# Altium project Assessment_2.PrjPcb
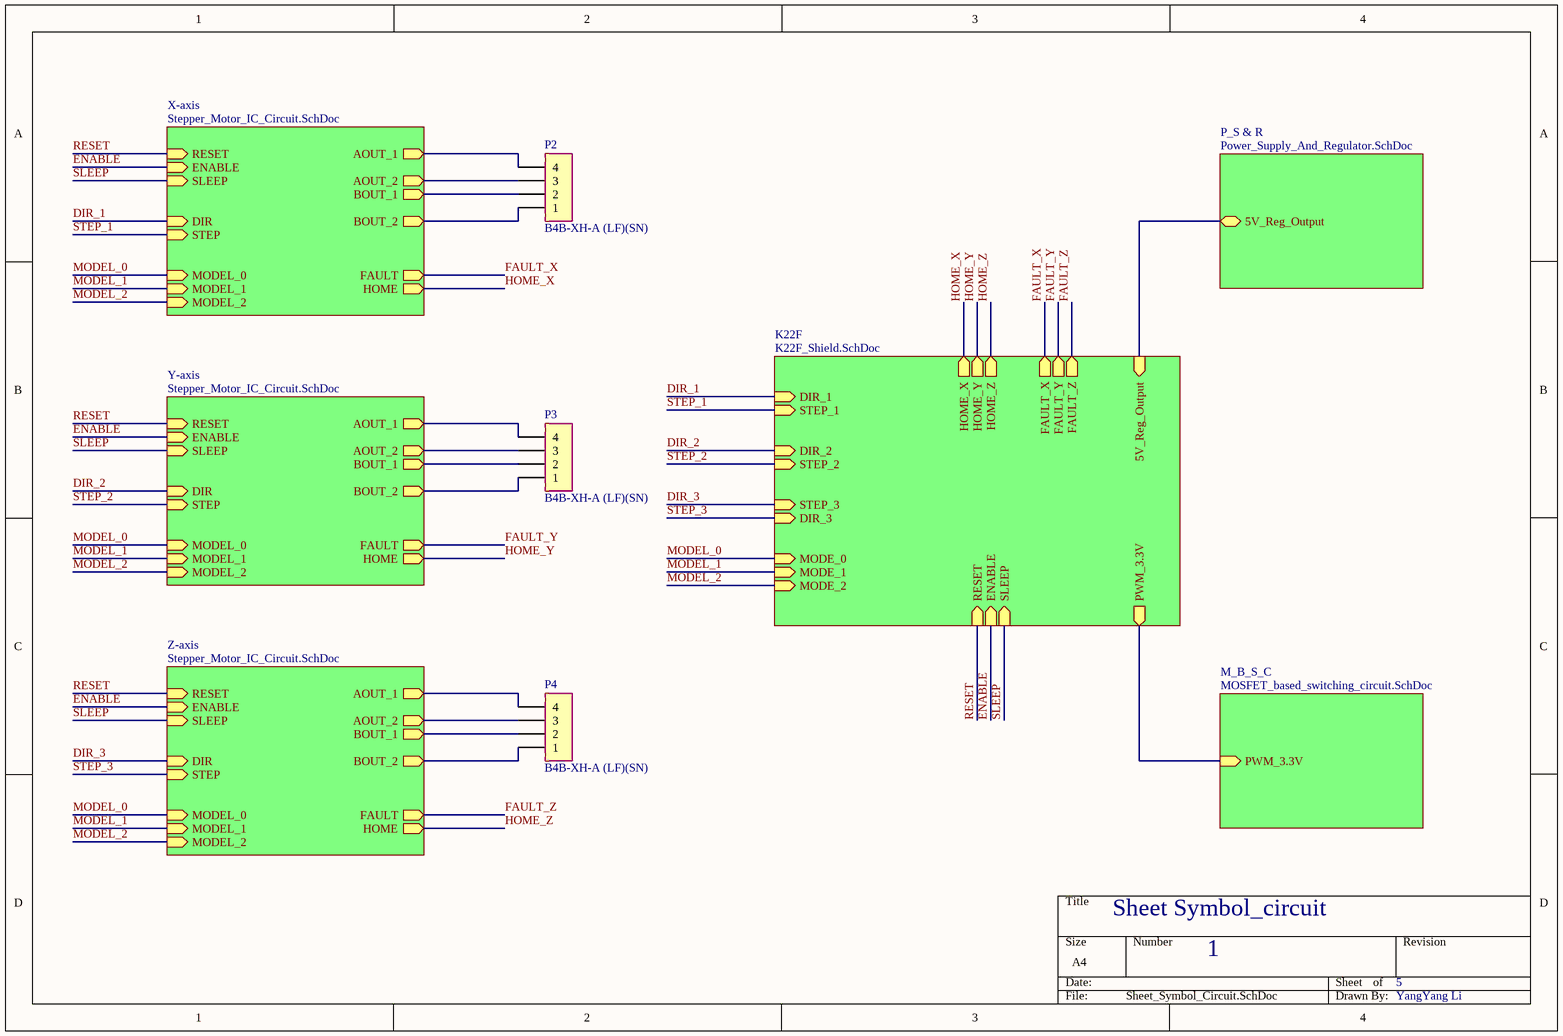
[diagram p0: Sheet_Symbol_Circuit.SchDoc]
5 sheets, 59 parts. Net scope: hierarchical (ports join the sheet entries above them; power ports are global).
Board files: PCB1.PcbDoc, Assessment_2_PCB.PcbDoc
Sheets:
  Sheet_Symbol_Circuit.SchDoc
    X-axis = Stepper_Motor_IC_Circuit.SchDoc
    Y-axis = Stepper_Motor_IC_Circuit.SchDoc
    Z-axis = Stepper_Motor_IC_Circuit.SchDoc
    K22F = K22F_Shield.SchDoc
    P_S & R = Power_Supply_And_Regulator.SchDoc
    M_B_S_C = MOSFET_based_switching_circuit.SchDoc

## Sheet Sheet_Symbol_Circuit.SchDoc
size A4; DocumentNumber: 1; SheetNumber: 1

### Parts
P2  B4B-XH-A (LF)(SN)  [B4B-XH-A (LF)(SN)]
P3  B4B-XH-A (LF)(SN)  [B4B-XH-A (LF)(SN)]
P4  B4B-XH-A (LF)(SN)  [B4B-XH-A (LF)(SN)]

### Sub-sheets
K22F = K22F_Shield.SchDoc: MODE_2 (in), MODE_0 (in), MODE_1 (in), SLEEP (in), ENABLE (in), RESET (in), PWM_3.3V (out), DIR_1 (in), STEP_1 (in), DIR_2 (in), STEP_2 (in), STEP_3 (in), DIR_3 (in), HOME_Y (out), HOME_Z (out), HOME_X (out), 5V_Reg_Output (in), FAULT_Y (out), FAULT_X (out), FAULT_Z (out)
M_B_S_C = MOSFET_based_switching_circuit.SchDoc: PWM_3.3V (in)
P_S & R = Power_Supply_And_Regulator.SchDoc: 5V_Reg_Output (bidir)
X-axis = Stepper_Motor_IC_Circuit.SchDoc: AOUT_1 (out), AOUT_2 (out), BOUT_1 (out), BOUT_2 (out), DIR (in), STEP (in), MODEL_0 (in), MODEL_1 (in), MODEL_2 (in), RESET (in), ENABLE (in), SLEEP (in), FAULT (out), HOME (out)
Y-axis = Stepper_Motor_IC_Circuit.SchDoc: AOUT_1 (out), AOUT_2 (out), BOUT_1 (out), BOUT_2 (out), DIR (in), STEP (in), MODEL_0 (in), MODEL_1 (in), MODEL_2 (in), RESET (in), ENABLE (in), SLEEP (in), FAULT (out), HOME (out)
Z-axis = Stepper_Motor_IC_Circuit.SchDoc: AOUT_1 (out), AOUT_2 (out), BOUT_1 (out), BOUT_2 (out), DIR (in), STEP (in), MODEL_0 (in), MODEL_1 (in), MODEL_2 (in), RESET (in), ENABLE (in), SLEEP (in), HOME (out), FAULT (out)

### Nets
DIR_1: sheet X-axis/DIR, sheet K22F/DIR_1
DIR_2: sheet Y-axis/DIR, sheet K22F/DIR_2
DIR_3: sheet Z-axis/DIR, sheet K22F/STEP_3
ENABLE: sheet X-axis/ENABLE, sheet Y-axis/ENABLE, sheet Z-axis/ENABLE, sheet K22F/ENABLE
FAULT_X: sheet X-axis/FAULT, sheet K22F/FAULT_X
FAULT_Y: sheet Y-axis/FAULT, sheet K22F/FAULT_Y
FAULT_Z: sheet Z-axis/FAULT, sheet K22F/FAULT_Z
HOME_X: sheet X-axis/HOME, sheet K22F/HOME_X
HOME_Y: sheet Y-axis/HOME, sheet K22F/HOME_Y
HOME_Z: sheet Z-axis/HOME, sheet K22F/HOME_Z
MODEL_0: sheet X-axis/MODEL_0, sheet Y-axis/MODEL_0, sheet Z-axis/MODEL_0, sheet K22F/MODE_0
MODEL_1: sheet X-axis/MODEL_1, sheet Y-axis/MODEL_1, sheet Z-axis/MODEL_1, sheet K22F/MODE_1
MODEL_2: sheet X-axis/MODEL_2, sheet Y-axis/MODEL_2, sheet Z-axis/MODEL_2, sheet K22F/MODE_2
RESET: sheet X-axis/RESET, sheet Y-axis/RESET, sheet Z-axis/RESET, sheet K22F/RESET
SLEEP: sheet X-axis/SLEEP, sheet Y-axis/SLEEP, sheet Z-axis/SLEEP, sheet K22F/SLEEP
STEP_1: sheet X-axis/STEP, sheet K22F/STEP_1
STEP_2: sheet Y-axis/STEP, sheet K22F/STEP_2
STEP_3: sheet Z-axis/STEP, sheet K22F/DIR_3
Net*1_J24_2: sheet K22F/PWM_3.3V, sheet M_B_S_C/PWM_3.3V
Net*1_J25_16: sheet K22F/5V_Reg_Output, sheet P_S & R/5V_Reg_Output
NetP2_1: P2.1 ; sheet X-axis/BOUT_2
NetP2_2: P2.2 ; sheet X-axis/BOUT_1
NetP2_3: P2.3 ; sheet X-axis/AOUT_2
NetP2_4: P2.4 ; sheet X-axis/AOUT_1
NetP3_1: P3.1 ; sheet Y-axis/BOUT_2
NetP3_2: P3.2 ; sheet Y-axis/BOUT_1
NetP3_3: P3.3 ; sheet Y-axis/AOUT_2
NetP3_4: P3.4 ; sheet Y-axis/AOUT_1
NetP4_1: P4.1 ; sheet Z-axis/BOUT_2
NetP4_2: P4.2 ; sheet Z-axis/BOUT_1
NetP4_3: P4.3 ; sheet Z-axis/AOUT_2
NetP4_4: P4.4 ; sheet Z-axis/AOUT_1

### Notes on the sheet
- Sheet Symbol_circuit
- 1
- 5
- YangYang Li

### Library data of the parts
P2-P4 = B4B-XH-A (LF)(SN) Wire-to-board connector: Wire-to-board connector, vertical, 2.5mm, 4 contacts

## Sheet Stepper_Motor_IC_Circuit.SchDoc
size A4; DocumentNumber: 3; SheetNumber: 3
Used 3 times, as channels X-axis, Y-axis, Z-axis. Parts and nets are listed once, with the designators drawn on the sheet.
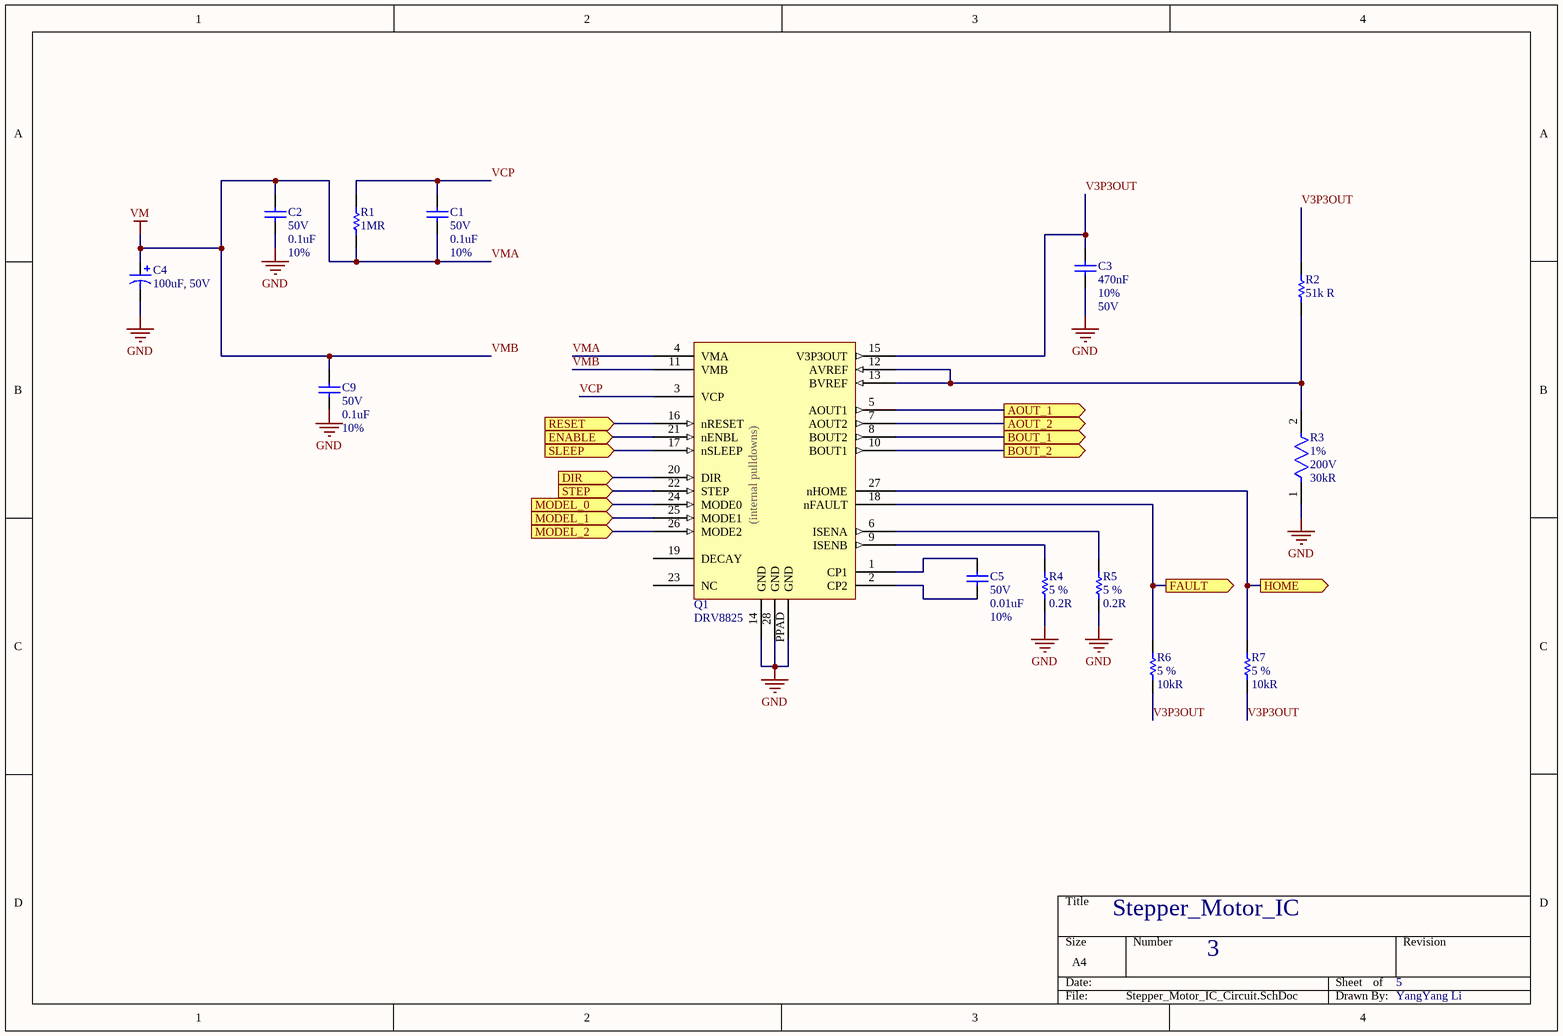
[diagram p1: Stepper_Motor_IC_Circuit.SchDoc]

### Parts
C1  Voltage Rating: 50V  Capacitance: 0.1uF  Tolerance: 10%  [KEMT-1206-2_L]  (hidden comment: C1206C103K5RACTU)
C2  Voltage Rating: 50V  Capacitance: 0.1uF  Tolerance: 10%  [KEMT-1206-2_L]  (hidden comment: C1206C103K5RACTU)
C3  Capacitance - nF: 470nF  Tolerance: 10%  Voltage Rating: 50V  [CAPC3216X100X50NL20T25]  (hidden comment: 1206C474K5RACTU)
C4  100uF, 50V  [Capacitor radial 8mm]
C5  Voltage Rating: 50V  Capacitance: 0.01uF  Tolerance: 10%  [KEMT-1206-2_L]  (hidden comment: C1206C103K5RACTU)
C9  Voltage Rating: 50V  Capacitance: 0.1uF  Tolerance: 10%  [KEMT-1206-2_L]  (hidden comment: C1206C103K5RACTU)
Q1  DRV8825  [DRV8825 HTSSOP]
R1  Resistance: 1MR  [RESC3216X70X50NL05T20]  (hidden comment: ERJ-8ENF1004V)
R2  51k R  [RESC3216X60X45NL10T20]
R3  Tolerance: 1%  Voltage Rating: 200V  Resistance: 30kR  [FP-CR1206-MFG]  (hidden comment: CR1206-FX-3002ELF)
R4  value 0.2R  Tolerance: 5 %  [RESC1206(3216)_L]  (hidden comment: 0.2R 5% 1206(3216))
R5  value 0.2R  Tolerance: 5 %  [RESC1206(3216)_L]  (hidden comment: 0.2R 5% 1206(3216))
R6  value 10kR  Tolerance: 5 %  [RESC1206(3216)_M]  (hidden comment: 10K 5% 1206(3216))
R7  value 10kR  Tolerance: 5 %  [RESC1206(3216)_M]  (hidden comment: 10K 5% 1206(3216))

### Ports
AOUT_1 (out), AOUT_2 (out), BOUT_1 (out), BOUT_2 (out), DIR (in), ENABLE (in), FAULT (out), HOME (out), MODEL_0 (in), MODEL_1 (in), MODEL_2 (in), RESET (in), SLEEP (in), STEP (in)

### Nets
GND: C2.2 C3.2 C4.2 C9.2 Q1.14(GND) Q1.28(GND) Q1.PPAD(GND) R3.1 R4.2 R5.2
VMA: C1.2 C2.1 C4.1 C9.1 Q1.4(VMA) Q1.11(VMB) R1.2  [also labelled VM, VMB]
AOUT_1: Q1.5(AOUT1) ; port AOUT_1
AOUT_2: Q1.7(AOUT2) ; port AOUT_2
BOUT_1: Q1.8(BOUT2) ; port BOUT_1
BOUT_2: Q1.10(BOUT1) ; port BOUT_2
DIR: Q1.20(DIR) ; port DIR
ENABLE: Q1.21(nENBL) ; port ENABLE
FAULT: Q1.18(nFAULT) R6.2 ; port FAULT
HOME: Q1.27(nHOME) R7.2 ; port HOME
MODEL_0: Q1.24(MODE0) ; port MODEL_0
MODEL_1: Q1.25(MODE1) ; port MODEL_1
MODEL_2: Q1.26(MODE2) ; port MODEL_2
RESET: Q1.16(nRESET) ; port RESET
SLEEP: Q1.17(nSLEEP) ; port SLEEP
STEP: Q1.22(STEP) ; port STEP
V3P3OUT: C3.1 Q1.15(V3P3OUT) R2.2 R6.1 R7.1
VCP: C1.1 Q1.3(VCP) R1.1
NetC5_1: C5.1 Q1.2(CP2)
NetC5_2: C5.2 Q1.1(CP1)
NetQ1_6: Q1.6(ISENA) R5.1
NetQ1_9: Q1.9(ISENB) R4.1
NetQ1_12: Q1.12(AVREF) Q1.13(BVREF) R2.1 R3.2

Not connected (* = marked no-connect by the designer): Q1 19(DECAY) 23(NC)

### Channels
X-axis: designators end in _X-axis; ports AOUT_1=NetP2_4 AOUT_2=NetP2_3 BOUT_1=NetP2_2 BOUT_2=NetP2_1 DIR=DIR_1 ENABLE=ENABLE FAULT=FAULT_X HOME=HOME_X MODEL_0=MODEL_0 MODEL_1=MODEL_1 MODEL_2=MODEL_2 RESET=RESET SLEEP=SLEEP STEP=STEP_1
Y-axis: designators end in _Y-axis; ports AOUT_1=NetP3_4 AOUT_2=NetP3_3 BOUT_1=NetP3_2 BOUT_2=NetP3_1 DIR=DIR_2 ENABLE=ENABLE FAULT=FAULT_Y HOME=HOME_Y MODEL_0=MODEL_0 MODEL_1=MODEL_1 MODEL_2=MODEL_2 RESET=RESET SLEEP=SLEEP STEP=STEP_2
Z-axis: designators end in _Z-axis; ports AOUT_1=NetP4_4 AOUT_2=NetP4_3 BOUT_1=NetP4_2 BOUT_2=NetP4_1 DIR=DIR_3 ENABLE=ENABLE FAULT=FAULT_Z HOME=HOME_Z MODEL_0=MODEL_0 MODEL_1=MODEL_1 MODEL_2=MODEL_2 RESET=RESET SLEEP=SLEEP STEP=STEP_3

### Notes on the sheet
- Stepper_Motor_IC
- 3
- 5
- YangYang Li
- (in symbol Stepper motor driver DRV8824) (internal pulldowns)

### Library data of the parts
C1 C2 C5 C9 = CMP-2000-06008-1: Surface Mount Multilayer Ceramic Chip Capacitor, X7R Dielectric, 50 V, -55 to 125 degC, 2-Pin SMD (1206), RoHS, Tape and Reel; Manufacturer: Kemet; Brand/Series: CSeries; Mounting Technology: SurfaceMount; Material, Element: Ceramic; Termination: SMD; Temperature Coefficient: X7R; Package Reference: 1206-2; Dimensions: 0.126"x0.063"(3.2x1.6mm)LxW; Package Description: 2-Leads SMD, Body 3.2 x 1.6 mm; Datasheet Version: 07/2013; Manufacturer URL: http://www.kemet.com/; Mounting Type: PCB; Case Size: 1206(3216mm); Datasheet URL: https://datasheet.ciiva.com/7729/1725435-7729792.pdf
C3 = CMP-2000-06016-1: Chip Capacitor, 470 nF, +/- 10%, 50 V, -55 to 125 degC, 1206 (3216 Metric), RoHS, Tape and Reel; Manufacturer: Kemet; Case Length: 3.2mm; Class: 2; Case Height: 0.9mm; Capacitance - pF: 470000pF; Dielectric: X7R; Case Width: 1.6mm; Temperature Coefficient / Code: +/-15%; Type: SMDMLCCsX7R,Commercial; Manufacturer URL: http://www.kemet.com/; Maximum Operating Temperature: +125C; Minimum Operating Temperature: -55C; Brand: Kemet; Case Code - in: 1206; Datasheet Version: 02/2016; Case Code - mm: 3216; Series: C1206C; Mounting Technology: SurfaceMount; Package Reference: 1206; Termination Style: SMD/SMT; Datasheet URL: http://www.kemet.com/docfinder?Partnumber=C1206C106K8RACTU; Dimensions: 1.6mmWx3.2mmLx0.9mmH; Packaging: Reel; Factory Pack Quantity: 4000; Product Category: MultilayerCeramicCapacitorsMLCC-SMD/SMT; RoHS: Details; Operating Temperature Range: -55Cto+125C; Product: GeneralTypeMLCCs; Voltage Rating DC: 50V; Package Description: 2-Pin Surface Mount Device, Body 3.2 x 1.6 mm; Package / Case: 1206(3216metric)
C4 = Cap 100uF, 50V, THT radial: Electrolytic Capacitor, 100 µF, 50 V, ± 20%, Radial Leaded, 8 mm
Q1 = Stepper motor driver DRV8824: TI DRV8825 Stepper Motor Controller IC
R1 = CMP-2003-00020-1: Manufacturer: Panasonic; Part Number: ERJ-8ENF1004V
R2 = CMP-2003-02261-1: CRCW120651K0JNEA; Manufacturer: Vishay Dale; Part Number: CRCW120651K0JNEA
R3 = CMP-07231-000998-1: Thick Film Chip Resistors 1206 30kΩ 0.25W 1% 100ppm/°C; Max Power Dissipation: 250mW; Max Operating Temperature: 155°C; Width: 1.6mm; Contact Plating: Tin; Thickness: 610um; Mount: Surface Mount; Case/Package: 1206; Package Quantity: 5000; Radiation Hardening: No; Case Code (Metric): 3216; Termination: SMD/SMT; Temperature Coefficient: 100ppm/°C; Power Rating: 250mW; Min Operating Temperature: -55°C; Number of Terminations: 2; Composition: Thick Film; Height: 0.03inch; Length: 3.2mm; Packaging: Tape and Reel; Depth: 1.6mm; Case Code (Imperial): 1206; Military Standard: Not
R4 R5 = CMP-1014-00057-1: 0.2R 0.25W 5% 1206 (3216 Metric)  SMD; Case-EIA: 1206; Case-Metric: 3216; Technology: SMT; Power: 0.25 W
R6 R7 = CMP-1014-00098-1: 10K 0.25W 5% 1206 (3216 Metric)  SMD; Case-Metric: 3216; Case-EIA: 1206; Power: 0.25 W; Technology: SMT

## Sheet K22F_Shield.SchDoc
size A4; DocumentNumber: 2; SheetNumber: 2
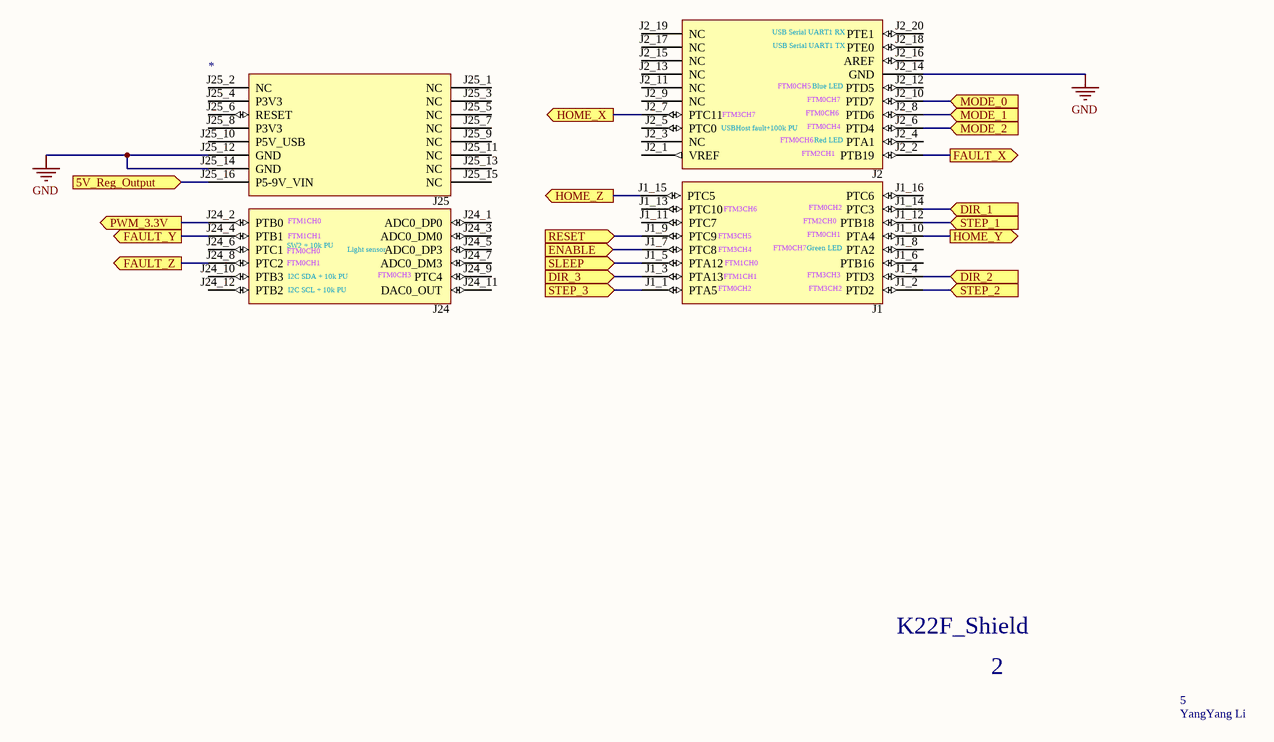
[diagram p2: K22F_Shield.SchDoc]

### Parts
*1  *  [FRDM-K22F]

### Ports
5V_Reg_Output (in), DIR_1 (in), DIR_2 (in), DIR_3 (in), ENABLE (in), FAULT_X (out), FAULT_Y (out), FAULT_Z (out), HOME_X (out), HOME_Y (out), HOME_Z (out), MODE_0 (in), MODE_1 (in), MODE_2 (in), PWM_3.3V (out), RESET (in), SLEEP (in), STEP_1 (in), STEP_2 (in), STEP_3 (in)

### Nets
GND: *1.J2_14(GND) *1.J25_12(GND) *1.J25_14(GND)
DIR_1: *1.J1_14(PTC3) ; port DIR_1
DIR_2: *1.J1_4(PTD3) ; port DIR_2
DIR_3: *1.J1_1(PTA5) ; port STEP_3
ENABLE: *1.J1_7(PTC8) ; port ENABLE
FAULT_X: *1.J2_2(PTB19) ; port FAULT_X
FAULT_Y: *1.J24_4(PTB1) ; port FAULT_Y
FAULT_Z: *1.J24_8(PTC2) ; port FAULT_Z
HOME_X: *1.J2_7(PTC11) ; port HOME_X
HOME_Y: *1.J1_10(PTA4) ; port HOME_Y
HOME_Z: *1.J1_15(PTC5) ; port HOME_Z
MODEL_0: *1.J2_10(PTD7) ; port MODE_0
MODEL_1: *1.J2_8(PTD6) ; port MODE_1
MODEL_2: *1.J2_6(PTD4) ; port MODE_2
RESET: *1.J1_9(PTC9) ; port RESET
SLEEP: *1.J1_5(PTA12) ; port SLEEP
STEP_1: *1.J1_12(PTB18) ; port STEP_1
STEP_2: *1.J1_2(PTD2) ; port STEP_2
STEP_3: *1.J1_3(PTA13) ; port DIR_3
Net*1_J24_2: *1.J24_2(PTB0) ; port PWM_3.3V
Net*1_J25_16: *1.J25_16(P5-9V_VIN) ; port 5V_Reg_Output

Not connected (* = marked no-connect by the designer): *1 J1_6(PTB16) J1_8(PTA2) J1_11(PTC7) J1_13(PTC10) J1_16(PTC6) J2_1(VREF) J2_3(NC) J2_4(PTA1) J2_5(PTC0) J2_9(NC) J2_11(NC) J2_12(PTD5) J2_13(NC) J2_15(NC) J2_16(AREF) J2_17(NC) J2_18(PTE0) J2_19(NC) J2_20(PTE1) J24_1(ADC0_DP0) J24_3(ADC0_DM0) J24_5(ADC0_DP3) J24_6(PTC1) J24_7(ADC0_DM3) J24_9(PTC4) J24_10(PTB3) J24_11(DAC0_OUT) J24_12(PTB2) J25_1(NC) J25_2(NC) J25_3(NC) J25_4(P3V3) J25_5(NC) J25_6(RESET) J25_7(NC) J25_8(P3V3) J25_9(NC) J25_10(P5V_USB) J25_11(NC) J25_13(NC) J25_15(NC)

### Notes on the sheet
- K22F_Shield
- 2
- 5
- YangYang Li
- (in symbol NXP FRDM-K22F) USB Serial UART1 RX; USB Serial UART1 TX; FTM0CH5; Blue LED; FTM0CH7; FTM3CH7; FTM0CH6; USBHost fault+100k PU; FTM0CH4; Red LED; FTM2CH1; J2; J25; FTM3CH6; FTM0CH2; FTM1CH0; FTM2CH0; FTM1CH1; FTM3CH5; FTM0CH1; SW2 + 10k PU; FTM0CH0; Light sensor; FTM3CH4; Green LED; I2C SDA + 10k PU; FTM0CH3; FTM3CH3; I2C SCL + 10k PU; FTM3CH2; J24; J1

### Library data of the parts
*1 = NXP FRDM-K22F

## Sheet Power_Supply_And_Regulator.SchDoc
size A4; DocumentNumber: 4; SheetNumber: 4
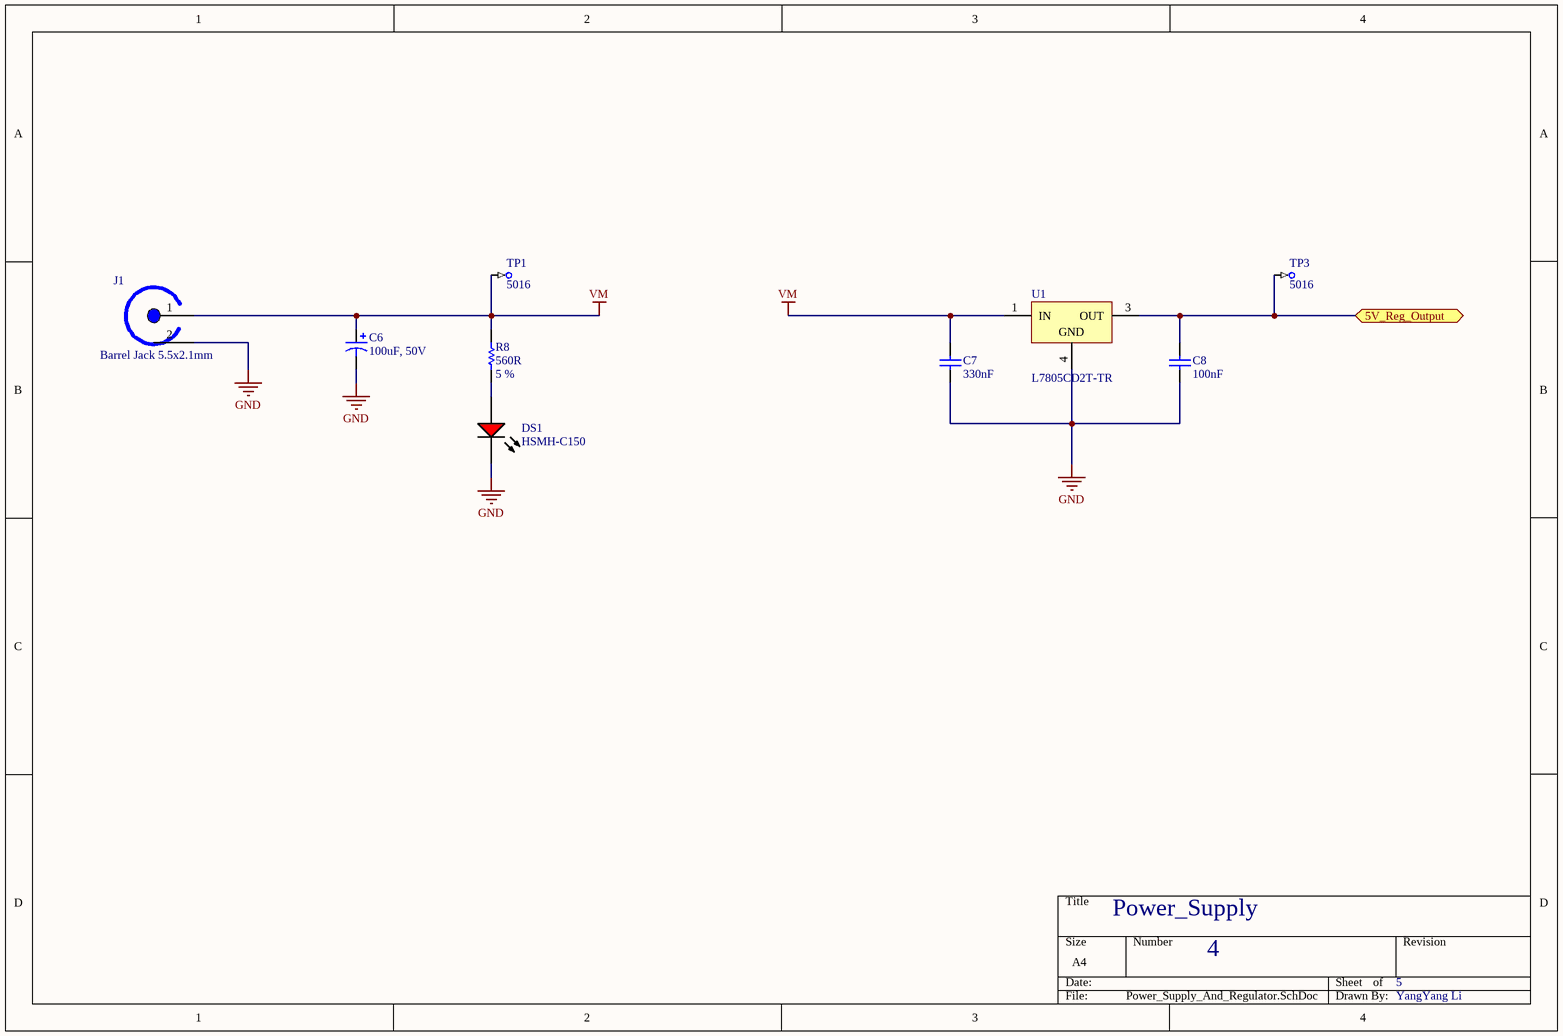
[diagram p3: Power_Supply_And_Regulator.SchDoc]

### Parts
C6  100uF, 50V  [Capacitor radial 8mm]
C7  330nF  [CAPC1608X87X35NL15T15]
C8  100nF  [CAPC2013X88X50NL20T25]
DS1  HSMH-C150  [AVAG-HSMX-C150_V]
J1  Barrel Jack 5.5x2.1mm  [Barrel Jack 2.1x5.5mm THT]
R8  value 560R  Tolerance: 5 %  [RESC1206(3216)_L]  (hidden comment: 560R 5% 1206(3216))
TP1  5016  [KEYSTONE-5016_V]
TP3  5016  [KEYSTONE-5016_V]
U1  L7805CD2T-TR  [TO-263_M]

### Ports
5V_Reg_Output (bidir)

### Nets
GND: C6.2 C7.1 C8.1 DS1.2(K) J1.2(SLEEVE) U1.4(GND)
VM: C6.1 C7.2 J1.1(TIP) R8.2 TP1.1 U1.1(IN)  [project net VMA]
Net*1_J25_16: C8.2 TP3.1 U1.3(OUT) ; port 5V_Reg_Output
NetDS1_1: DS1.1(A) R8.1

### Notes on the sheet
- Power_Supply
- 4
- 5
- YangYang Li

### Library data of the parts
C6 = Cap 100uF, 50V, THT radial: as C4 on sheet Stepper_Motor_IC_Circuit
C7 = CMP-2006-03186-1: C0603C334K4RACTU; Manufacturer: Kemet; Part Number: C0603C334K4RACTU
C8 = CMP-2007-00279-1: C0805C104K5RACTU; Manufacturer: Kemet; Part Number: C0805C104K5RACTU
DS1 = CMP-2000-06426-1: LED Uni-Color Red, 65 mW, 25 mA, -40 to 85 degC, 2-Pin SMD, RoHS, Tape and Reel; Manufacturer: Avago; Product Height (mm): 1.1mm; Power Dissipation: 78W; Product Length (mm): 3.2mm; Forward Voltage: 2.6V; Luminous Intensity: 17mcd; DELETED: Compliant; Shape Type: Rectangular; Peak Wavelength: 660nm; Main Category: ChipLED; Dominant Wave Length: 639nm; Rad Hardened: No; Lens Type: ColorlessDiffused; Product Depth (mm): 1.6mm; Reverse Voltage: 5V; Forward Current: 25mA; Chip Material: GaAlAs; Test Current (It): 20mA; Viewing Angle: 170deg; Number of  Elements: 1; Type: Uni-Color; Package Reference: HSMX-C150; Package Description: 2-Pin Surface Mount Device, Body 3.2 x 1.6 mm; Operating Temp Range: -40Cto85C; Mounting: SurfaceMount; Emitting Color: Red; Pin Count: 2; Operating Temperature Classification: Industrial; Datasheet URL: http://media.digikey.com/pdf/Data%20Sheets/Avago%20PDFs/HSMz-Czzz.pdf; Package Type: ChipLed; Mounting Technology: SurfaceMount; High Brightness: No; Lens Dimensions: 2x1.6x0.6mm; Manufacturer URL: http://www.avagotech.com/; Lum Intensity: 17mcd; Datasheet Version: 03/2012; Packaging: TapeandReel
J1 = Barrel Jack 5.5x2.1mm: GCT DCJ200-10-A-K1-K
R8 = CMP-1014-00068-1: 560R 0.25W 5% 1206 (3216 Metric)  SMD; Case-Metric: 3216; Case-EIA: 1206; Power: 0.25 W; Technology: SMT
TP1 TP3 = CMP-2000-05178-1: Test Point, 1-Pin SMT, RoHS, Tape and Reel; Manufacturer: Keystone; Other Names: 5016KDKR; Featured Product: SurfaceMountTestPoints / 5019MiniatureSurfaceMountTestPoint; Online Catalog: SurfaceMountTestPoints; Catalog Drawings: 5016Top / 5016Side / 5016Front; Packaging: Digi-Reel; RoHS Information: RoHSComplianceStatement; Package Reference: 5016; Mounting Type: SurfaceMount; Type: PCTestPoint,Compact; Manufacturer URL: http://www.keyelco.com/; Standard Package: 1; Package Description: 1-Pin Test Point, Body 3.81 x 2.04 mm; Category: TestandMeasurement; Terminal: 0.015"(0.38mm)PhosphorBronze,SilverPlated; Datasheet URL: https://ciiva.com/datasheet-click-2917613?src=ciiva&sig=4a4e90f; Datasheet Version: Rev. D, 03/2014; Family: TestPoints; Material: PhosphorBronze
U1 = CMP-0244-00213-1: Positive Voltage Regulator, 3-Pin D2PAK, Tape and Reel; PackageReference: TO-263; ComponentLink2URL: http://www.st.com/internet/com/TECHNICAL_RESOURCES/TECHNICAL_LITERATURE/DATASHEET/CD00000444.pdf; PackageDescription: 3-Pin Transistor Outline Package 2.54 mm Pitch, 15.4 mm Lead Span (D2PAK); DatasheetVersion: 16/11/2011; ComponentLink2Description: Datasheet; ComponentLink1Description: Manufacturer URL; PackageVersion: 2011; ComponentLink1URL: http://www.st.com

## Sheet MOSFET_based_switching_circuit.SchDoc: iuiuiu
size A4; DocumentNumber: 5; SheetNumber: 5
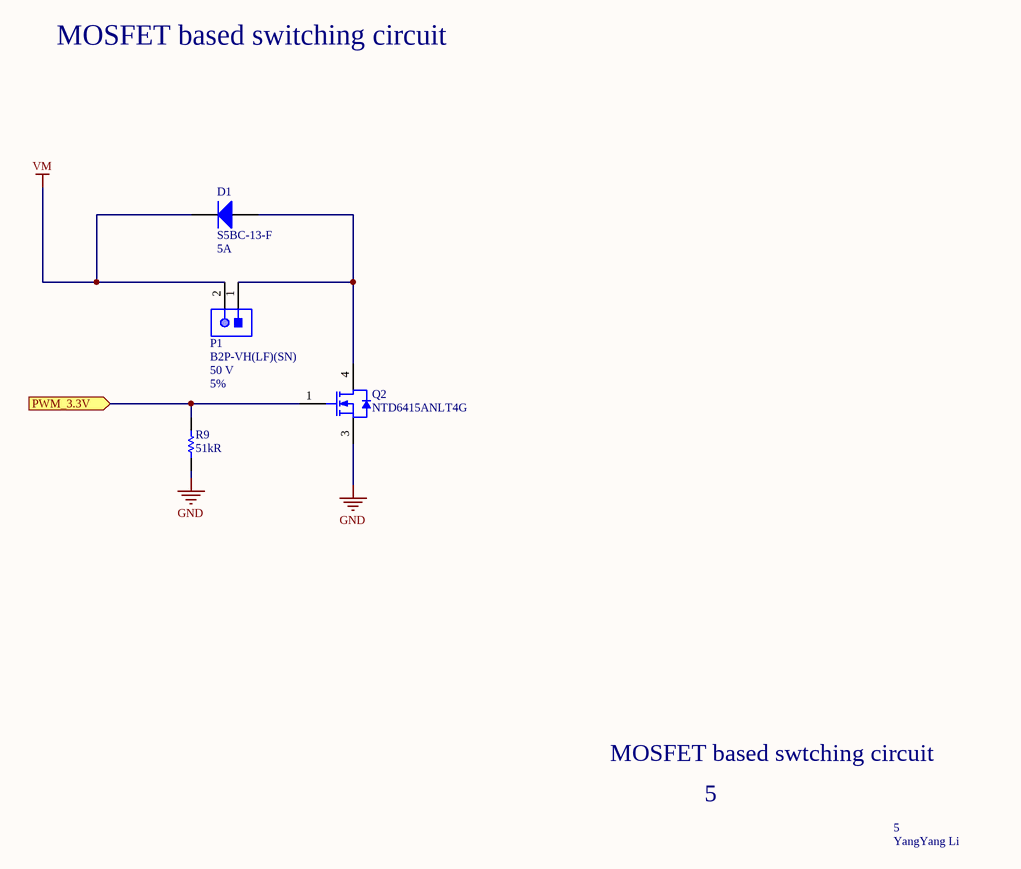
[diagram p4: MOSFET_based_switching_circuit.SchDoc]

### Parts
D1  S5BC-13-F  Average Rectified Current-Max: 5A  [DIOD-S5xC_V]
P1  B2P-VH(LF)(SN)  Voltage Rating: 50 V  Tolerance: 5%  [JST-B2P-VH(LF)(SN)_V]
Q2  NTD6415ANLT4G  [ONSC-DPAK-3-369AA-01_V]
R9  51kR  [RESC3216X60X45NL10T20]

### Ports
PWM_3.3V (in)

### Nets
GND: Q2.3(S) R9.1
VM: D1.2(K) P1.2  [project net VMA]
Net*1_J24_2: Q2.1(G) R9.2 ; port PWM_3.3V
NetD1_1: D1.1(A) P1.1 Q2.4(D)

### Notes on the sheet
- MOSFET based switching circuit
- MOSFET based swtching circuit
- 5
- YangYang Li

### Library data of the parts
D1 = CMP-2000-07025-1: Surface Mount Glass Passivated Rectifier, 5 A, 100 V, -65 to 150 degC, 2-Pin SMC, RoHS, Tape and Reel; Manufacturer: Diodes Inc; Reverse Current-Max: 10µA; Peak Current-Max: 100A; Reverse Voltage-Max [Vrrm]: 100V; Forward Voltage: 1.15V; Datasheet URL: http://www.diodes.com/_files/datasheets/ds16007.pdf; Package Description: 2-Pin Molded Component, Body 6.855 x 5.905 mm; Manufacturer URL: http://www.diodes.com/; Datasheet Version: Rev. 9-2, 09/2010; Package Reference: S5xC; Mounting Technology: SurfaceMount
P1 = CMP-1755-00002-1: Male Header, Pitch 3.96 mm, 1 x 2 Position, Height 10.9 mm, Tail Length 3.7 mm, -25 to 85 degC, RoHS, Bulk; Capacitance: 27 pF; Type (Capacitors): C0G; Resistance: 100000000000 Ohm; ComponentLink2Description: Datasheet; Height: 0.8 mm; Radiation Hardening: No; Pins: 2; Package Quantity: 4000; Max Operating Temperature: 125degC; Width: 0.8 mm; PackageDescription: Male Header, Pitch 3.96 mm, 1 x 2 Position, Height 10.9 mm, Tail Length 3.7 mm; Case/Package: 0603; Voltage Rating (DC): 50 V; PackageReference: B2P-VH(LF)(SN); REACH SVHC: No SVHC; Mount: Surface Mount; Min Operating Temperature: -55degC; Case Code (Metric): 1608; ComponentLink2URL: http://www.jst-mfg.com/product/pdf/eng/eVH.pdf; DatasheetVersion: May-16; RoHSCompliant: True; ComponentLink1Description: Manufacturer URL; Case Code (Imperial): 0603; Length: 1.6 mm; Packaging: Tape and Reel; ComponentLink1URL: http://www.jst.com/home2.html
Q2 = CMP-1058-00352-1: N-Channel Power MOSFET, 100 V, 23 A, 56 mOhm, 3-Pin DPAK, Pb-Free, Tape and Reel; Manufacturer: On Semiconductor; VGS(th) Max (V): 2; ID Max (A): 23; VGS Max (V): 20; Configuration: Single; Coss Typ (pF): 156; Crss Typ (pF): 70; Qrr Typ (nC): 152; Ciss Typ (pF): 1024; Channel Polarity: N Channel; PD Max (W): 83; ComponentLink1URL: http://www.onsemi.com/; Mounting Technology: Surface Mount; ComponentLink2URL: http://www.onsemi.cn/pub_link/Collateral/NTD6415ANL-D.PDF; RoHS: Pb-Free; PackageVersion: Rev. B, 06/2010; Packing: Tape and Reel; PackageReference: DPAK-3-369AA-01; DatasheetVersion: Rev. 1; ComponentLink1Description: Manufacturer URL; Package Type: DPAK-3; PackageDescription: 3-Pin Flange Mount, Body 6.54 x 6.095 mm, Pitch 2.29 mm; ComponentLink3URL: http://www.onsemi.cn/pub_link/Collateral/369AA.PDF; ComponentLink3Description: Package Specification; PartNumber: NTD6415ANLT4G; ComponentLink2Description: Datasheet
R9 = CMP-2003-02261-1: as R2 on sheet Stepper_Motor_IC_Circuit; Part Number: CRCW120651K0JNEA

## Nets that join several sheets
GND: X-axis (10 pins), Y-axis (10 pins), Z-axis (10 pins), K22F_Shield (*1.J2_14 *1.J25_12 *1.J25_14), Power_Supply_And_Regulator (6 pins), MOSFET_based_switching_circuit (Q2.3 R9.1)
VMA: X-axis (7 pins), Y-axis (7 pins), Z-axis (7 pins), Power_Supply_And_Regulator (6 pins), MOSFET_based_switching_circuit (D1.2 P1.2)
DIR_1: X-axis (Q1_X-axis.20), K22F_Shield (*1.J1_14)
DIR_2: Y-axis (Q1_Y-axis.20), K22F_Shield (*1.J1_4)
DIR_3: Z-axis (Q1_Z-axis.20), K22F_Shield (*1.J1_1)
ENABLE: X-axis (Q1_X-axis.21), Y-axis (Q1_Y-axis.21), Z-axis (Q1_Z-axis.21), K22F_Shield (*1.J1_7)
FAULT_X: X-axis (Q1_X-axis.18 R6_X-axis.2), K22F_Shield (*1.J2_2)
FAULT_Y: Y-axis (Q1_Y-axis.18 R6_Y-axis.2), K22F_Shield (*1.J24_4)
FAULT_Z: Z-axis (Q1_Z-axis.18 R6_Z-axis.2), K22F_Shield (*1.J24_8)
HOME_X: X-axis (Q1_X-axis.27 R7_X-axis.2), K22F_Shield (*1.J2_7)
HOME_Y: Y-axis (Q1_Y-axis.27 R7_Y-axis.2), K22F_Shield (*1.J1_10)
HOME_Z: Z-axis (Q1_Z-axis.27 R7_Z-axis.2), K22F_Shield (*1.J1_15)
MODEL_0: X-axis (Q1_X-axis.24), Y-axis (Q1_Y-axis.24), Z-axis (Q1_Z-axis.24), K22F_Shield (*1.J2_10)
MODEL_1: X-axis (Q1_X-axis.25), Y-axis (Q1_Y-axis.25), Z-axis (Q1_Z-axis.25), K22F_Shield (*1.J2_8)
MODEL_2: X-axis (Q1_X-axis.26), Y-axis (Q1_Y-axis.26), Z-axis (Q1_Z-axis.26), K22F_Shield (*1.J2_6)
Net*1_J24_2: K22F_Shield (*1.J24_2), MOSFET_based_switching_circuit (Q2.1 R9.2)
Net*1_J25_16: K22F_Shield (*1.J25_16), Power_Supply_And_Regulator (C8.2 TP3.1 U1.3)
NetP2_1: Sheet_Symbol_Circuit (P2.1), X-axis (Q1_X-axis.10)
NetP2_2: Sheet_Symbol_Circuit (P2.2), X-axis (Q1_X-axis.8)
NetP2_3: Sheet_Symbol_Circuit (P2.3), X-axis (Q1_X-axis.7)
NetP2_4: Sheet_Symbol_Circuit (P2.4), X-axis (Q1_X-axis.5)
NetP3_1: Sheet_Symbol_Circuit (P3.1), Y-axis (Q1_Y-axis.10)
NetP3_2: Sheet_Symbol_Circuit (P3.2), Y-axis (Q1_Y-axis.8)
NetP3_3: Sheet_Symbol_Circuit (P3.3), Y-axis (Q1_Y-axis.7)
NetP3_4: Sheet_Symbol_Circuit (P3.4), Y-axis (Q1_Y-axis.5)
NetP4_1: Sheet_Symbol_Circuit (P4.1), Z-axis (Q1_Z-axis.10)
NetP4_2: Sheet_Symbol_Circuit (P4.2), Z-axis (Q1_Z-axis.8)
NetP4_3: Sheet_Symbol_Circuit (P4.3), Z-axis (Q1_Z-axis.7)
NetP4_4: Sheet_Symbol_Circuit (P4.4), Z-axis (Q1_Z-axis.5)
RESET: X-axis (Q1_X-axis.16), Y-axis (Q1_Y-axis.16), Z-axis (Q1_Z-axis.16), K22F_Shield (*1.J1_9)
SLEEP: X-axis (Q1_X-axis.17), Y-axis (Q1_Y-axis.17), Z-axis (Q1_Z-axis.17), K22F_Shield (*1.J1_5)
STEP_1: X-axis (Q1_X-axis.22), K22F_Shield (*1.J1_12)
STEP_2: Y-axis (Q1_Y-axis.22), K22F_Shield (*1.J1_2)
STEP_3: Z-axis (Q1_Z-axis.22), K22F_Shield (*1.J1_3)